# Altium schematic sheet IFX_Shield2Go_DPS368_v1_0_S2G.SchDoc: <Project Name>
size A3; ApprovedBy: <Appr.>; Author: <Author>; CompanyName: Infineon Technologies AG; Engineer: <Rel.>; Organization: Infineon Technologies AG; Address1: COM AC SDC SD3; Address2: Am Campeon 1-12  -  85579 Neubiberg  -  Germany; Address3: 85579 Neubiberg; Address4: Germany; Revision: <Rev.>; Release: RC00; PageSetup: Record=PageOptions|CenterHorizontal=True|CenterVertical=True|PrintScale=1.01|XCorrection=1.00|YCorrection=1.00|PrintKind=0|BorderSize=5000000|LeftOffset=0|BottomOffset=0|Orientation=2|PaperLength=1000|PaperWidth=1000|Scale=100|PaperSource=7|PrintQuality=-4|MediaType=1|DitherType=10|PaperKind=A3|PrintScaleMode=1; Doc_ConfidentialStatus: <Doc_ConfidentialStatus>; Doc_Preliminary: <Doc_Preliminary>
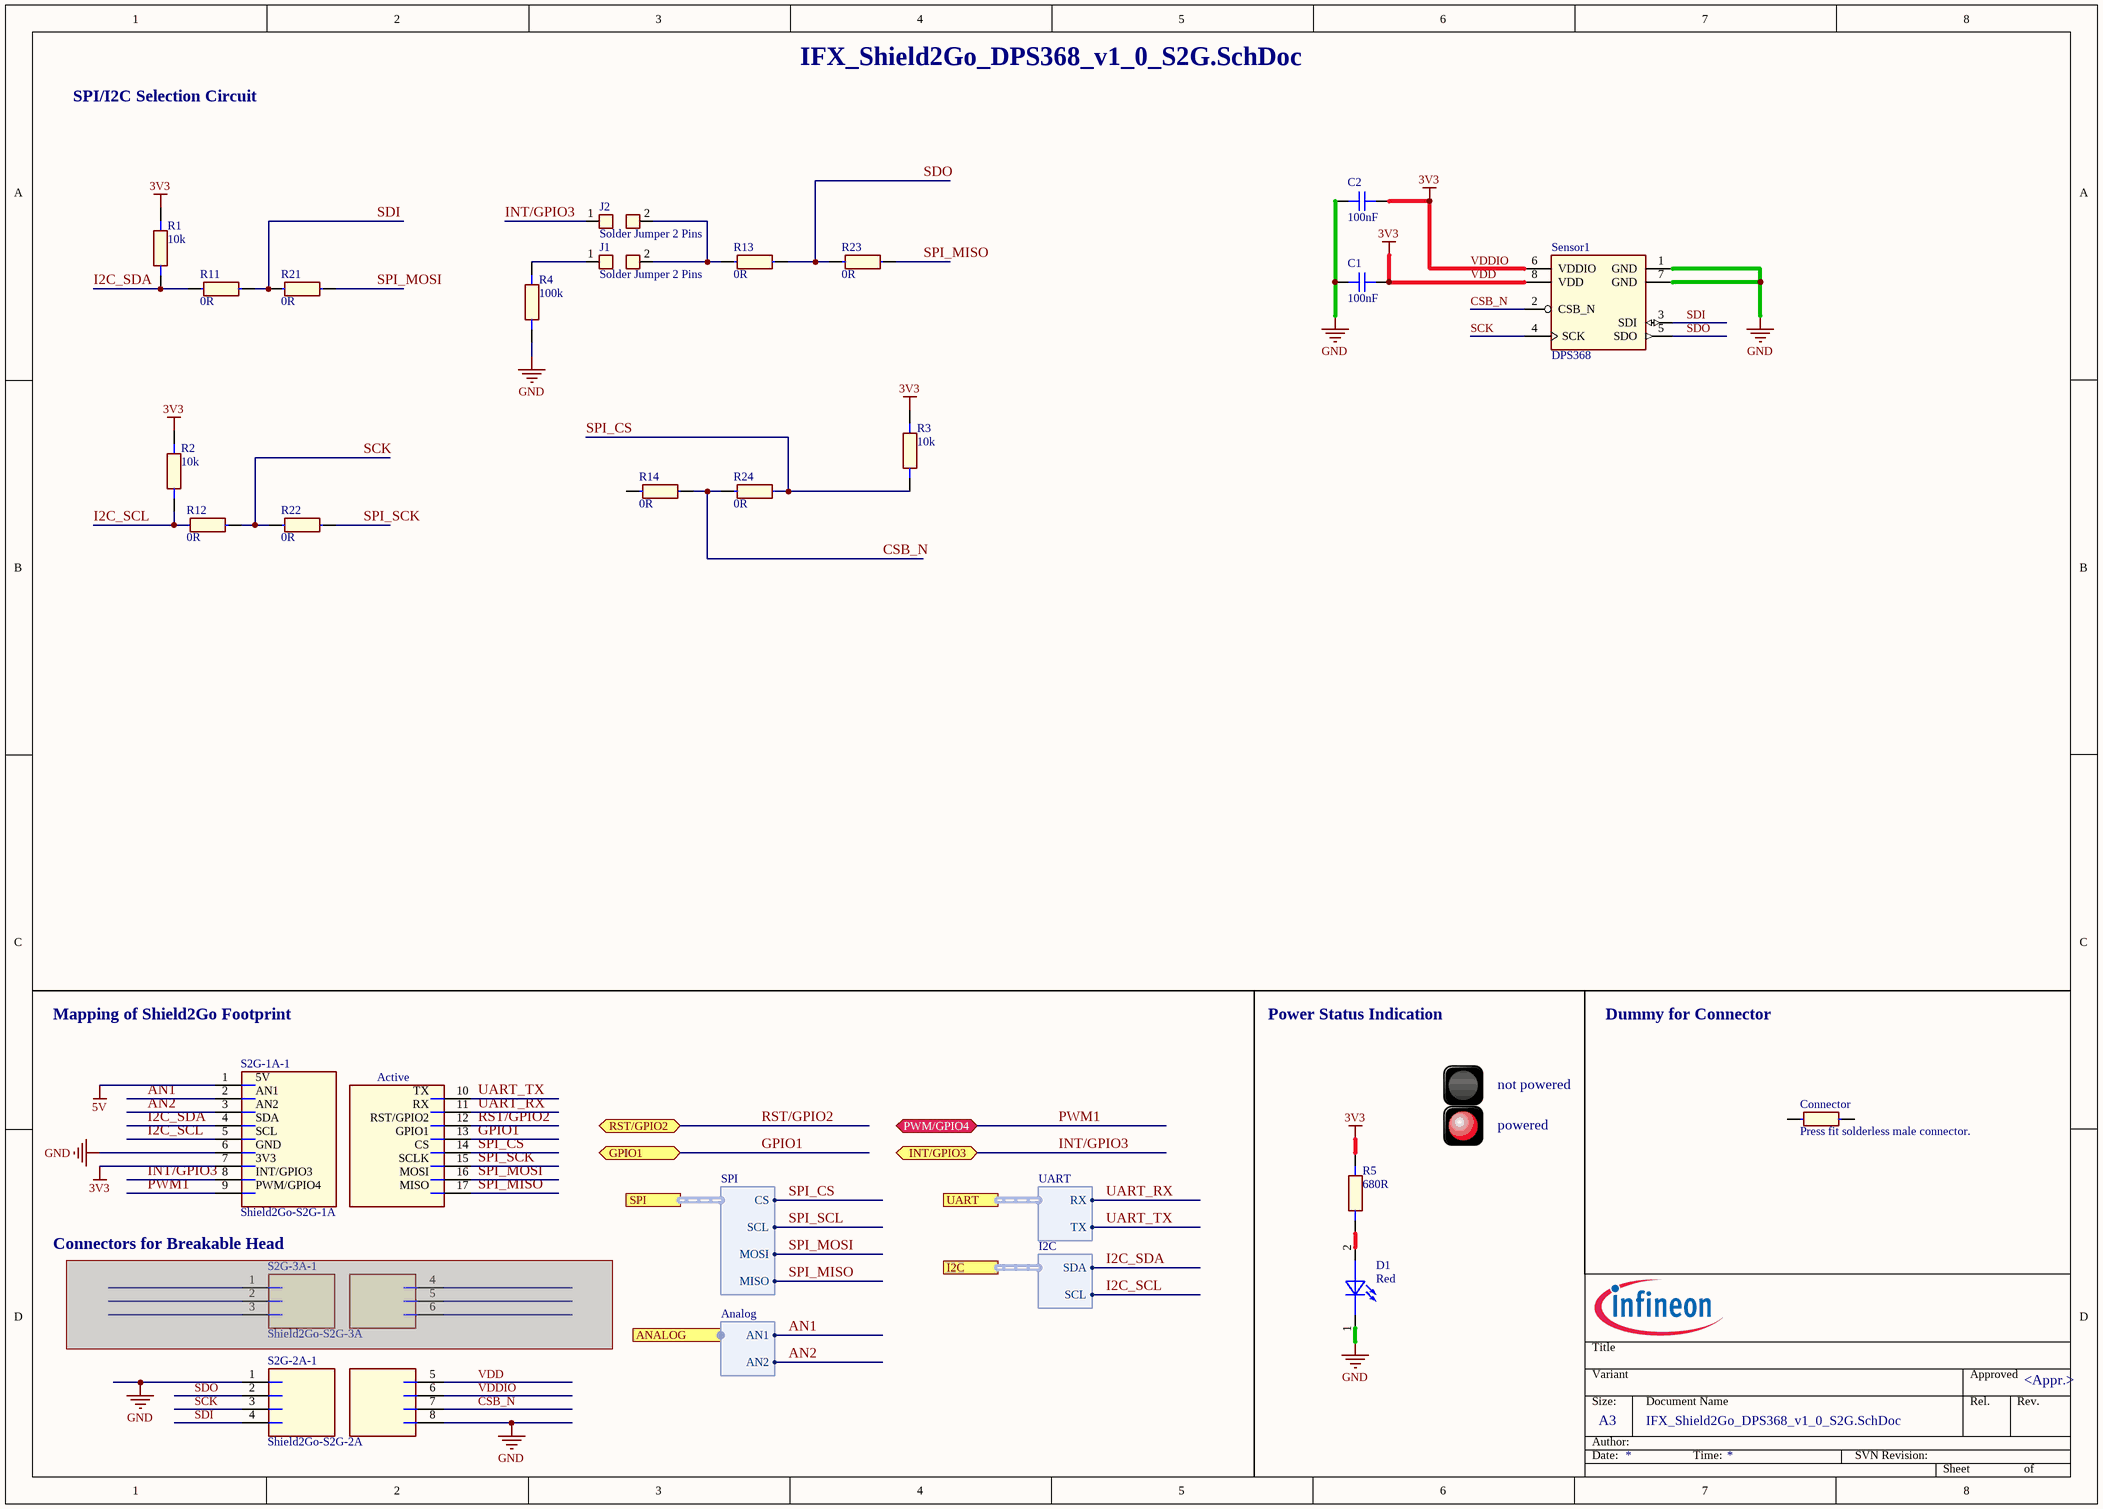
[diagram p0: IFX_Shield2Go_DPS368_v1_0_S2G.SchDoc]

## Parts
C1  100nF  [CAPC1005X55N-0]
C2  100nF  [CAPC1005X55N-0]
Connector  Press fit solderless male connector.  (mechanical)
D1  Red  [LEDC2013X90N]
J1  Solder Jumper 2 Pins  [SOLDER_BRIDGE_0.7X1.299PAD]  (no BOM)
J2  Solder Jumper 2 Pins  [SOLDER_BRIDGE_0.7X1.299PAD]  (no BOM)
R1  10k  [RESC1005X03N]
R2  10k  [RESC1005X03N]
R3  10k  [RESC1005X03N]
R4  100k  [RESC1005X03N]
R5  680R  [RESC1005X03N]
R11  0R  [RESC2013X60N]
R12  0R  [RESC2013X60N]
R13  0R  [RESC2013X60N]
R14  0R  [RESC2013X60N]
R21  0R  [RESC2013X60N]
R22  0R  [RESC2013X60N]
R23  0R  [RESC2013X60N]
R24  0R  [RESC2013X60N]
S2G-1A-1  Shield2Go-S2G-1A  [Shield2Go_S2G_1A]  (no BOM)
S2G-2A-1  Shield2Go-S2G-2A  [PIN_8_2R_4_A]  (no BOM)
S2G-3A-1  Shield2Go-S2G-3A  [PIN_6_2R_3_A]  (no BOM)  (masked out: inside a compile mask, not in the netlist)
Sensor1  DPS368  [LGA8S145X65P2X4_200X250X100]

## Ports
ANALOG (harness Analog), GPIO1 (bidir), I2C (harness I2C), INT/GPIO3 (bidir), PWM/GPIO4 (bidir), RST/GPIO2 (bidir), SPI (harness SPI), UART (harness UART)

## Harnesses
I2C: SCL, SDA
SPI: CS, MISO, MOSI, SCL
UART: RX, TX
Analog: AN2, AN1

## Nets
5V: S2G-1A-1.1
GND: C1.1 C2.1 D1.1(Cathode) R4.1 S2G-1A-1.6 S2G-2A-1.1 S2G-2A-1.8 Sensor1.1(GND) Sensor1.7(GND)
VDD: C1.2 C2.2 R1.2 R2.2 R3.2 R5.2 S2G-1A-1.7 S2G-2A-1.5 S2G-2A-1.6 Sensor1.6(VDDIO) Sensor1.8(VDD)  [also labelled 3V3, VDDIO]
AN1: S2G-1A-1.2 ; port ANALOG.AN1
AN2: S2G-1A-1.3 ; port ANALOG.AN2
CSB_N: R14.2 R24.1 S2G-2A-1.7 Sensor1.2(CSB_N)
GPIO1: S2G-1A-1.13 ; port GPIO1
I2C_SCL: R2.1 R12.2 S2G-1A-1.5 ; port I2C.SCL
I2C_SDA: R1.1 R11.2 S2G-1A-1.4 ; port I2C.SDA
INT/GPIO3: J2.1 S2G-1A-1.8 ; port INT/GPIO3
PWM1: S2G-1A-1.9 ; port PWM/GPIO4
RST/GPIO2: S2G-1A-1.12 ; port RST/GPIO2
SCK: R12.1 R22.1 S2G-2A-1.3 Sensor1.4(SCK)
SDI: R11.1 R21.1 S2G-2A-1.4 Sensor1.3(SDI)
SDO: R13.1 R23.1 S2G-2A-1.2 Sensor1.5(SDO)
SPI_CS: R3.1 R24.2 S2G-1A-1.14 ; port SPI.CS
SPI_MISO: R23.2 S2G-1A-1.17 ; port SPI.MISO
SPI_MOSI: R21.2 S2G-1A-1.16 ; port SPI.MOSI
SPI_SCK: R22.2 S2G-1A-1.15
SPI_SCL: port SPI.SCL
UART_RX: S2G-1A-1.11 ; port UART.RX
UART_TX: S2G-1A-1.10 ; port UART.TX
NetD1_2: D1.2(Anode) R5.1
NetJ1_1: J1.1 R4.2
NetJ1_2: J1.2 J2.2 R13.2

Not connected (* = marked no-connect by the designer): Connector 1 2; R14 1

## Notes on the sheet
- SPI/I2C Selection Circuit
- Mapping of Shield2Go Footprint
- Power Status Indication
- Dummy for Connector
- not powered
- powered
- Connectors for Breakable Head
- Title
- Variant
- Approved
- Date:
- Author:
- Size:
- A3
- Document Name
- Time:
- SVN Revision:
- Rel.
- Rev.
- Sheet
- of
- (in symbol Shield2Go-S2G-1A) 5V; AN1; TX; AN2; RX; SDA; RST/GPIO2; SCL; GPIO1; GND; CS; 3V3; SCLK; INT/GPIO3; MOSI; PWM/GPIO4; MISO

## Library data of the parts
C1 C2 = 263544: Chip Monolithic Ceramic Capacitor; Manufacturer: muRata; Manufacturer Component Status: Active; Multiple Parts: No; Legacy PartNumber: CAP01001501; Manufacturer Order Number: GRM155R60J104JA01; Type: Standard; ComponentStatus: Released; Symbol Type: Capacitor; Single; Standard; 2 Pins; Alternate View: Yes; Article Number: 263544; Version Number: V01; Tolerance Neg: 5%; Combined Parameters: TC:X5R (EIA);Tol.:-5%/+5%;Vdc:6.3V; Style: Single; Value: 100nF; PackageReference: CAPC1005X55N-0; ComponentLink1Description: Vendor WebSite; ComponentLink1URL: http://www.murata.com; ComponentLink2Description: Datasheet; ComponentLink2URL: http://webnetprod.muc.infineon.com/pcbportal_prod/WorkFlows/AltiumComponent/StandardDocumentation?Versionid=263545; Supplier 1: Farnell; Supplier 2: DigiKey; Supplier 3: Mouser; Legacy DeviceID: CAP01001501; Part Type: Capacitor; Tolerance Pos: 5%; Application: Standard; Technology: Ceramic; Temperature min: -55; Temperature max: 85; Temperature Range: Military; RoHS Compliant: Y; Automotive Qualified: No; Second Source allowed: Yes
Connector = 328131: Dummy for Press Fit Connector.; Manufacturer: Fischer Elektronik; Manufacturer Component Status: Active; Multiple Parts: No; Manufacturer Order Number: SLP 1 16 117 17 Z; Alternate View: Yes; ComponentStatus: Released; Style: Single; Type: Standard; Supplier 1: Fischer Elektronik; Supplier Part Number 1: SLP 1 16 117 17 Z; Value: Press fit solderless male connector.; ComponentLink1Description: Vendor WebSite; ComponentLink1URL: www.fischerelektronik.de; ComponentLink2Description: Component Webpage; ComponentLink2URL: https://www.fischerelektronik.de/web_fischer/de_DE/Steckverbinder/G01/Stiftleisten/PR/SLP%201%2016%20117/index.xhtml; Part Type: Connector; RoHS Compliant: Y; Automotive Qualified: No; Second Source allowed: Yes
D1 = 394426: Mini-mold Chip LED, Red; Manufacturer: Rohm Semiconductors; Manufacturer Component Status: Active; Legacy PartNumber: DIO01300220; Manufacturer Order Number: SML-211UTT86K; Symbol Type: Standard LED Symbol, 1 Cathode, 2 Anode; ComponentStatus: Released; Article Number: 394426; Version Number: V01; Combined Parameters: Vf:1.8V;If:2mA;Ur:4V;Ir:100ÂµA;Pmax:44mW; Style: Single; Automotive Qualified: No; Second Source allowed: Yes; Value: Red; Supplier 1: Farnell; Supplier 2: DigiKey; Supplier Part Number 2: 511-1292-2-ND; Supplier 3: Mouser; Supplier Part Number 3: 755-SML-211UTT86; PackageReference: 2012(0805); ComponentLink1Description: Vendor WebSite; ComponentLink1URL: http://www.rohm.com; ComponentLink2Description: Datasheet; ComponentLink2URL: http://webnetprod.muc.infineon.com/pcbportal_prod/WorkFlows/AltiumComponent/StandardDocumentation?Versionid=394427; Legacy DeviceID: DIO01300220; Part Type: Diode; Type: LED; Application: Standard; Temperature min: -30; Temperature max: 85; Temperature Range: Military; RoHS Compliant: N
J1 J2 = 433601: Multiple Parts: No; Manufacturer: Infineon Technologies AG; Manufacturer Component Status: Active; Legacy PartNumber: CON01500959; Alternate View: Yes; ComponentStatus: Released; Article Number: 433601; Version Number: V01; Legacy DeviceID: IFX_Solder Jumper 2 Pins; Combined Parameters: - None (onboard);2x1;Mounting:SMT;Orient:SMT;Shielded:No; Style: Not Applicable; Symbol Type: Solder Jumper 2 Pins; Supplier 1: Farnell; Supplier 2: DigiKey; Supplier 3: Mouser; Value: Solder Jumper 2 Pins; ComponentLink1Description: Vendor WebSite; ComponentLink1URL: http://infineon.com; ComponentLink2Description: Datasheet; Part Type: Connector; Manufacturer Order Number: Solder Jumper 2 Pins; Temperature Range: Military; RoHS Compliant: N; Automotive Qualified: No; Second Source allowed: Yes
R1-R3 = 327561: General Purpose Chip Resistor; Manufacturer: Yageo; Manufacturer Component Status: Active; Multiple Parts: No; Legacy PartNumber: RES00000037; Manufacturer Order Number: RC0402FR-0710KL; Alternate View: Yes; ComponentStatus: Not Validated; Symbol Type: Resistor; Single; Standard; 2 Pins; Article Number: 327561; Version Number: V01; Tolerance Neg: 1%; Combined Parameters: TCR:100ppm/K;Tol.:-1%/+1%;Vdc:50V;Idc:-;P:63mW; Style: Single; Type: Standard; Supplier 1: Farnell; Supplier 2: DigiKey; Supplier 3: Mouser; PackageReference: 0402; Value: 10k; ComponentLink1Description: Vendor WebSite; ComponentLink1URL: http://www.yageo.com/; ComponentLink2Description: Datasheet; ComponentLink2URL: http://webnetprod.muc.infineon.com/pcbportal_prod/WorkFlows/AltiumComponent/StandardDocumentation?Versionid=327562; Legacy DeviceID: RES00000037; Part Type: Resistor; Tolerance Pos: 1%; Technology: Thick Film; Temperature min: -55; Temperature max: 155; Temperature Range: Military; RoHS Compliant: Y; Automotive Qualified: No; Second Source allowed: Yes
R4 = 327621: General Purpose Chip Resistor; Manufacturer: Yageo; Manufacturer Component Status: Active; Multiple Parts: No; Legacy PartNumber: RES00000049; Manufacturer Order Number: RC0402FR-07100KL; Alternate View: Yes; ComponentStatus: Not Validated; Symbol Type: Resistor; Single; Standard; 2 Pins; Article Number: 327621; Version Number: V01; Tolerance Neg: 1%; Combined Parameters: TCR:100ppm/K;Tol.:-1%/+1%;Vdc:50V;Idc:-;P:63mW; Style: Single; Type: Standard; Supplier 1: Farnell; Supplier 2: DigiKey; Supplier 3: Mouser; PackageReference: 0402; Value: 100k; ComponentLink1Description: Vendor WebSite; ComponentLink1URL: http://www.yageo.com/; ComponentLink2Description: Datasheet; ComponentLink2URL: http://webnetprod.muc.infineon.com/pcbportal_prod/WorkFlows/AltiumComponent/StandardDocumentation?Versionid=327622; Legacy DeviceID: RES00000049; Part Type: Resistor; Tolerance Pos: 1%; Technology: Thick Film; Temperature min: -55; Temperature max: 155; Temperature Range: Military; RoHS Compliant: Y; Automotive Qualified: No; Second Source allowed: Yes
R5 = 327491: General Purpose Chip Resistor; Manufacturer: Yageo; Manufacturer Component Status: Active; Multiple Parts: No; Legacy PartNumber: RES00000023; Manufacturer Order Number: RC0402FR-07680RL; Alternate View: Yes; ComponentStatus: Not Validated; Symbol Type: Resistor; Single; Standard; 2 Pins; Article Number: 327491; Version Number: V01; Tolerance Neg: 1%; Combined Parameters: TCR:100ppm/K;Tol.:-1%/+1%;Vdc:50V;Idc:-;P:63mW; Style: Single; Type: Standard; Supplier 1: Farnell; Supplier 2: DigiKey; Supplier 3: Mouser; PackageReference: 0402; Value: 680R; ComponentLink1Description: Vendor WebSite; ComponentLink1URL: http://www.yageo.com/; ComponentLink2Description: Datasheet; ComponentLink2URL: http://webnetprod.muc.infineon.com/pcbportal_prod/WorkFlows/AltiumComponent/StandardDocumentation?Versionid=327492; Legacy DeviceID: RES00000023; Part Type: Resistor; Tolerance Pos: 1%; Technology: Thick Film; Temperature min: -55; Temperature max: 155; Temperature Range: Military; RoHS Compliant: Y; Automotive Qualified: No; Second Source allowed: Yes
R11-R14 R21-R24 = 328131: General Purpose Chip Resistor; Manufacturer: Yageo; Manufacturer Component Status: Active; Multiple Parts: No; Legacy PartNumber: RES00000150; Manufacturer Order Number: RC0805JR-070RL; Symbol Type: Resistor; Single; Standard; 2 Pins; Alternate View: Yes; ComponentStatus: Released; Article Number: 328131; Version Number: V01; Combined Parameters: TCR:0ppm/K;Tol.:-0R/+0R;Vdc:150V;Idc:2A;P:125mW; Style: Single; Type: Standard; Supplier 1: Farnell; Supplier Part Number 1: 9233750RL; Supplier 2: DigiKey; Supplier Part Number 2: 311-0.0ARTR-ND; Supplier 3: Mouser; Supplier Part Number 3: 603-RC0805JR-070RL; PackageReference: 0805; Value: 0R; ComponentLink1Description: Vendor WebSite; ComponentLink1URL: http://www.yageo.com/; ComponentLink2Description: Datasheet; ComponentLink2URL: http://webnetprod.muc.infineon.com/pcbportal_prod/WorkFlows/AltiumComponent/StandardDocumentation?Versionid=328132; Legacy DeviceID: RES00000150; Part Type: Resistor; Tolerance Neg: 0R; Tolerance Pos: 0R; Technology: Thick Film; Temperature min: -55; Temperature max: 155; Temperature Range: Military; RoHS Compliant: Y; Automotive Qualified: No; Second Source allowed: Yes
S2G-1A-1 = Shield2Go-S2G-1A: 17 Pin Connector for Shield2Go Boards; Manufacturer: Infineon Technologies; Manufacturer Component Status: Active; AutomotiveQualified: no; ComponentName: S2G-1A; ComponentStatus: Released; ComponentHeight: 0mm; ComponentLink1Description: Vendor WebSite; ComponentLink1URL: http://www.infineon.com; ComponentLink2Description: Datasheet
S2G-2A-1 = Shield2Go-S2G-2A: 8 Pin Connector for Head of Shield2Go Boards; Manufacturer: Infineon Technologies; Manufacturer Component Status: Active; AutomotiveQualified: no; ComponentName: S2G-2A; ComponentStatus: Released; ComponentHeight: 0mm; ComponentLink1Description: Vendor WebSite; ComponentLink1URL: http://www.infineon.com; ComponentLink2Description: Datasheet
S2G-3A-1 = Shield2Go-S2G-3A: 6 Pin Connector for Head of Shield2Go Boards; Manufacturer: Infineon Technologies; Manufacturer Component Status: Active; AutomotiveQualified: no; ComponentName: S2G-3A; ComponentStatus: Released; ComponentHeight: 0mm; ComponentLink1Description: Vendor WebSite; ComponentLink1URL: http://www.infineon.com; ComponentLink2Description: Datasheet
Sensor1 = 478666: Digital Barometric Sensor for Portable and IOT Device; Manufacturer: Infineon; Manufacturer Component Status: Active; Symbol Type: Digital Barometric Sensor for Portable and IOT Devices; ComponentStatus: Released; Alternate View: No; Article Number: 478666; Version Number: V01; Legacy DeviceID: IFX_DPS368; Combined Parameters: - -;Vdc min/max:1.7V/3.6V;Iout:-;Fmax:-; Second Source allowed: Yes; Value: DPS368; Supplier 1: Farnell; Supplier 2: DigiKey; Supplier 3: Mouser; PackageReference: LGA-8; ComponentLink1Description: Vendor WebSite; ComponentLink1URL: http://www.infineon.com; ComponentLink2Description: Datasheet; ComponentLink2URL: http://webnetprod.muc.infineon.com/pcbportal_prod/WorkFlows/AltiumComponent/StandardDocumentation?Versionid=478667; Multiple Parts: No; Part Type: Integrated Circuit; Manufacturer Order Number: DPS368; Temperature min: -40; Temperature max: 85; Temperature Range: Industrial; RoHS Compliant: Y